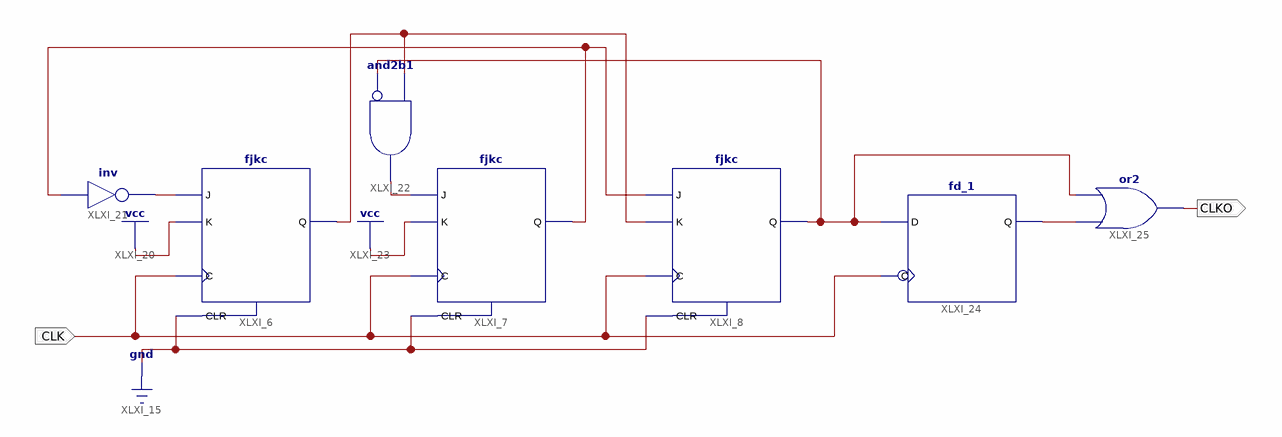
[diagram p0: schematic sheet 1]
// Xilinx ISE schematic clkdiv5.sch (spartan6) as structural Verilog: 7 symbols, 2 ports
module clkdiv5 (
  input  CLK,
  output CLKO
);

  wire XLXN_29, XLXN_30, XLXN_33, XLXN_34, XLXN_35, XLXN_38;

  fjkc XLXI_7 (.C(CLK), .CLR(1'b0), .J(XLXN_35), .K(1'b1), .Q(XLXN_30));
  fjkc XLXI_8 (.C(CLK), .CLR(1'b0), .J(XLXN_30), .K(XLXN_34), .Q(XLXN_33));
  fjkc XLXI_6 (.C(CLK), .CLR(1'b0), .J(XLXN_29), .K(1'b1), .Q(XLXN_34));
  not XLXI_21 (XLXN_29, XLXN_30);
  and XLXI_22 (XLXN_35, ~XLXN_33, XLXN_34);  // and2b1
  fd_1 XLXI_24 (.C(CLK), .D(XLXN_33), .Q(XLXN_38));
  or XLXI_25 (CLKO, XLXN_38, XLXN_33);
endmodule
